# EAGLE design modulation (EAGLE 9.2.2)
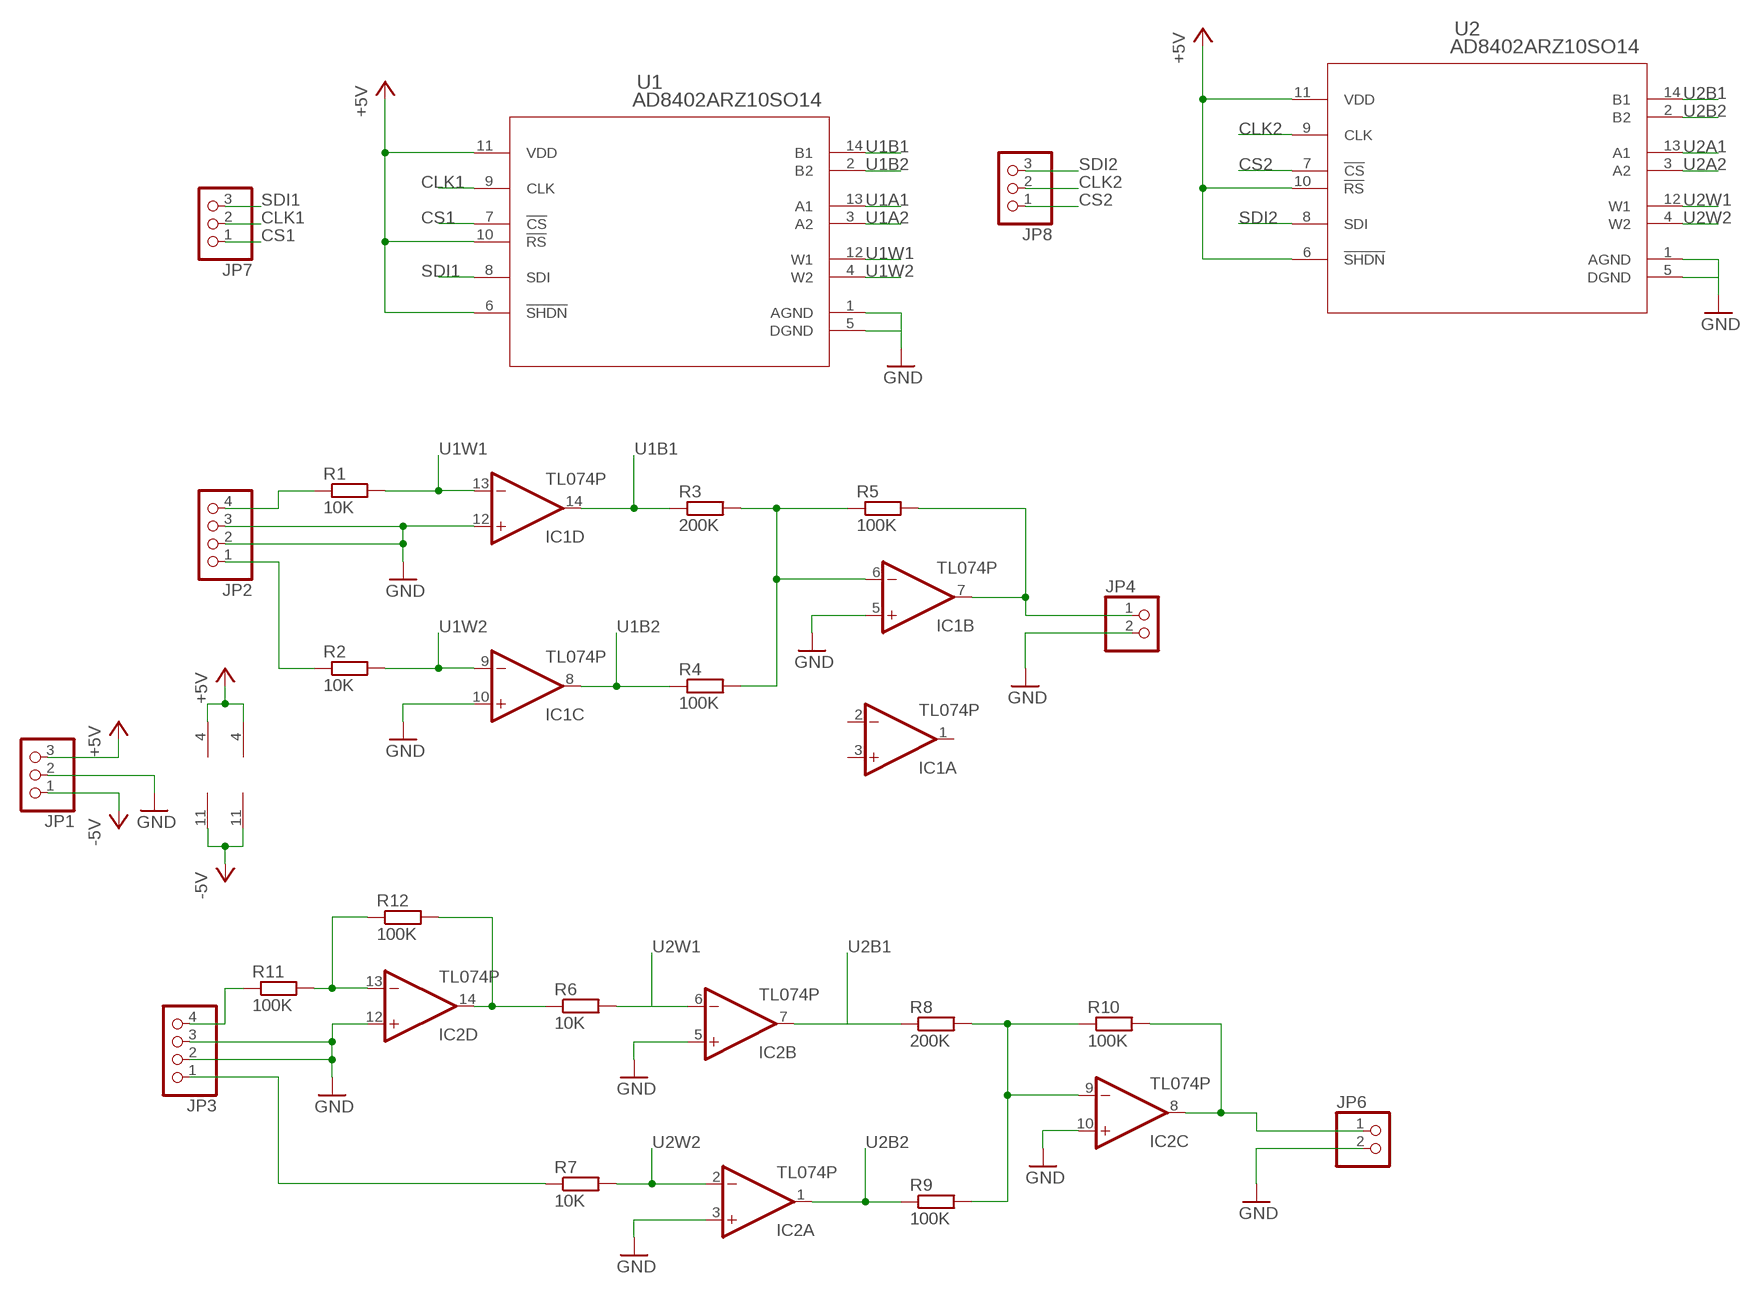
[diagram p0: schematic, sheet 1]

## Parts
IC1  TL074P  [DIL14]
IC2  TL074P  [DIL14]
JP1  PINHD-1X3  [1X03]
JP2  PINHD-1X4  [1X04]
JP3  PINHD-1X4  [1X04]
JP4  PINHD-1X2  [1X02]
JP6  PINHD-1X2  [1X02]
JP7  PINHD-1X3  [1X03]
JP8  PINHD-1X3  [1X03]
R1  10K  R-EU_0207/7  [0207/7]
R2  10K  R-EU_0207/7  [0207/7]
R3  200K  R-EU_0207/7  [0207/7]
R4  100K  R-EU_0207/7  [0207/7]
R5  100K  R-EU_0207/7  [0207/7]
R6  10K  R-EU_0207/7  [0207/7]
R7  10K  R-EU_0207/7  [0207/7]
R8  200K  R-EU_0207/7  [0207/7]
R9  100K  R-EU_0207/7  [0207/7]
R10  100K  R-EU_0207/7  [0207/7]
R11  100K  R-EU_0207/7  [0207/7]
R12  100K  R-EU_0207/7  [0207/7]
U1  AD8402ARZ10SO14  [SO14]
U2  AD8402ARZ10SO14  [SO14]

## Nets
+5V [power]: IC1.4(P:V+) IC2.4(P:V+) JP1.3 U1.6(!SHDN) U1.10(!RS) U1.11(VDD) U2.6(!SHDN) U2.10(!RS) U2.11(VDD)
-5V [power]: IC1.11(P:V-) IC2.11(P:V-) JP1.1
CLK1: JP7.2 U1.9(CLK)
CLK2: JP8.2 U2.9(CLK)
CS1: JP7.1 U1.7(!CS)
CS2: JP8.1 U2.7(!CS)
GND [power]: IC1.5(B:+IN) IC1.10(C:+IN) IC1.12(D:+IN) IC2.3(A:+IN) IC2.5(B:+IN) IC2.10(C:+IN) IC2.12(D:+IN) JP1.2 JP2.2 JP2.3 JP3.2 JP3.3 JP4.2 JP6.2 U1.1(AGND) U1.5(DGND) U2.1(AGND) U2.5(DGND)
N$1: IC1.6(B:-IN) R3.2 R4.2 R5.1
N$2: JP2.4 R1.1
N$3: JP2.1 R2.1
N$4: IC2.14(D:OUT) R6.1 R12.2
N$5: IC1.7(B:OUT) JP4.1 R5.2
N$6: JP3.1 R7.1
N$7: IC2.9(C:-IN) R8.2 R9.2 R10.1
N$8: IC2.8(C:OUT) JP6.1 R10.2
N$9: JP3.4 R11.1
N$10: IC2.13(D:-IN) R11.2 R12.1
SDI1: JP7.3 U1.8(SDI)
SDI2: JP8.3 U2.8(SDI)
U1A1: U1.13(A1)
U1A2: U1.3(A2)
U1B1: IC1.14(D:OUT) R3.1 U1.14(B1)
U1B2: IC1.8(C:OUT) R4.1 U1.2(B2)
U1W1: IC1.13(D:-IN) R1.2 U1.12(W1)
U1W2: IC1.9(C:-IN) R2.2 U1.4(W2)
U2A1: U2.13(A1)
U2A2: U2.3(A2)
U2B1: IC2.7(B:OUT) R8.1 U2.14(B1)
U2B2: IC2.1(A:OUT) R9.1 U2.2(B2)
U2W1: IC2.6(B:-IN) R6.2 U2.12(W1)
U2W2: IC2.2(A:-IN) R7.2 U2.4(W2)
Unconnected: IC1.1(A:OUT) IC1.2(A:-IN) IC1.3(A:+IN)

## Library data of the parts
IC1 IC2 = linear:TL074: OP AMP
JP1 JP7 JP8 = pinhead:PINHD-1X3: PIN HEADER
JP2 JP3 = pinhead:PINHD-1X4: PIN HEADER
JP4 JP6 = pinhead:PINHD-1X2: PIN HEADER
R1-R12 = rcl:R-EU_: RESISTOR, European symbol; SPICEPREFIX: R
U1 U2 = cusotm_comps:AD8402ARZ10

## Net classes
0 signal: width 0.3 mm, drill 0.5 mm, clearance 0.3 mm
1 power: width 0.3 mm, drill 0.5 mm, clearance 0.5 mm to class 0, clearance 0.5 mm

## Board
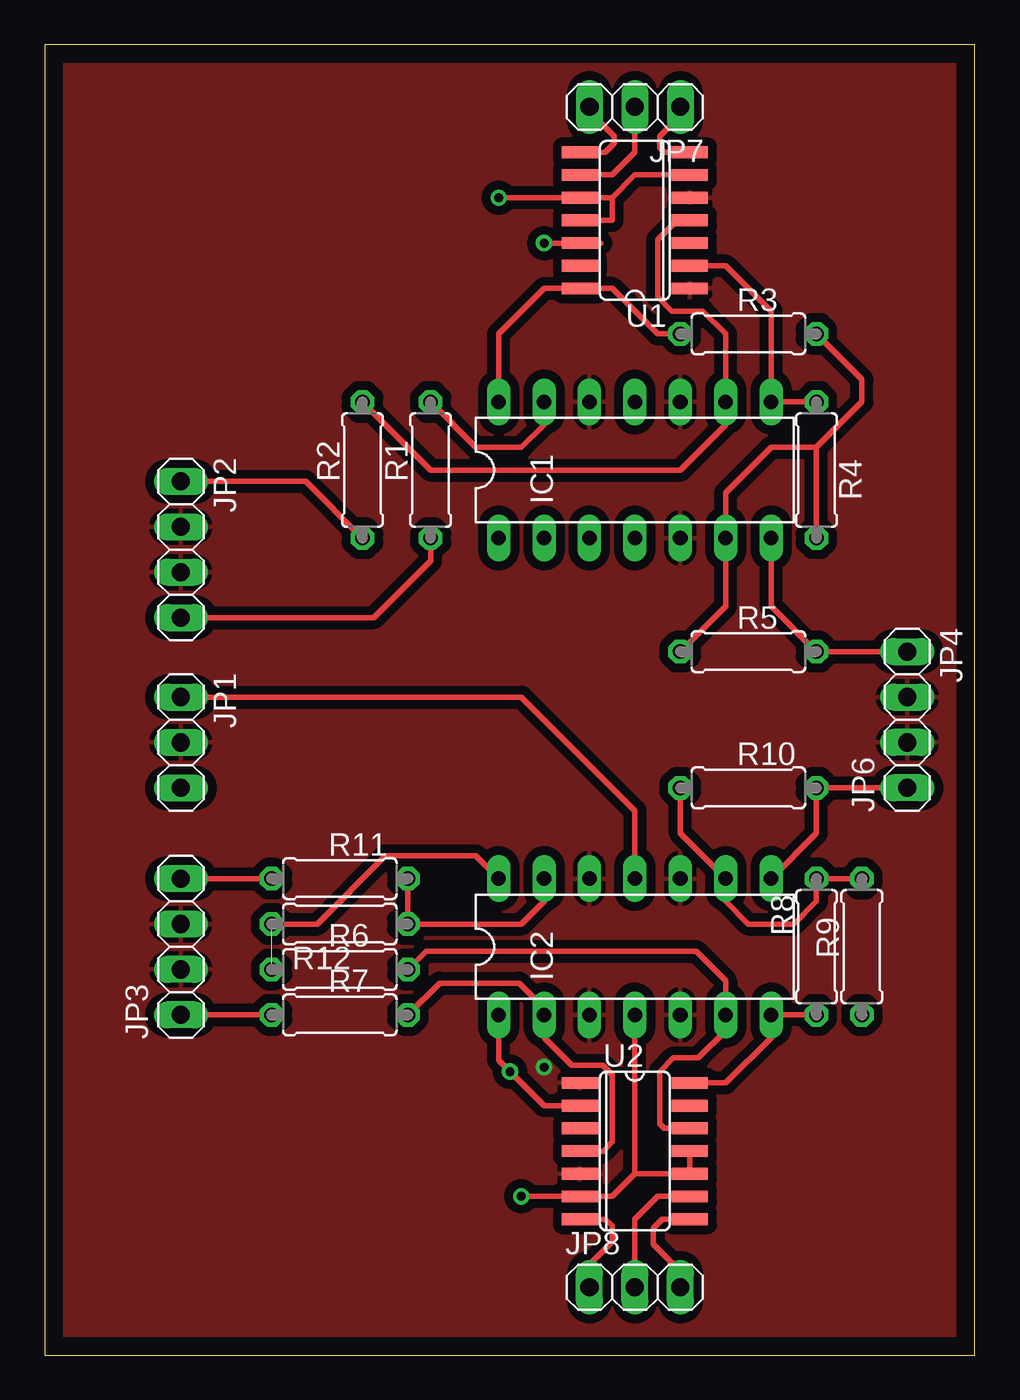
[diagram p1: board, top side]
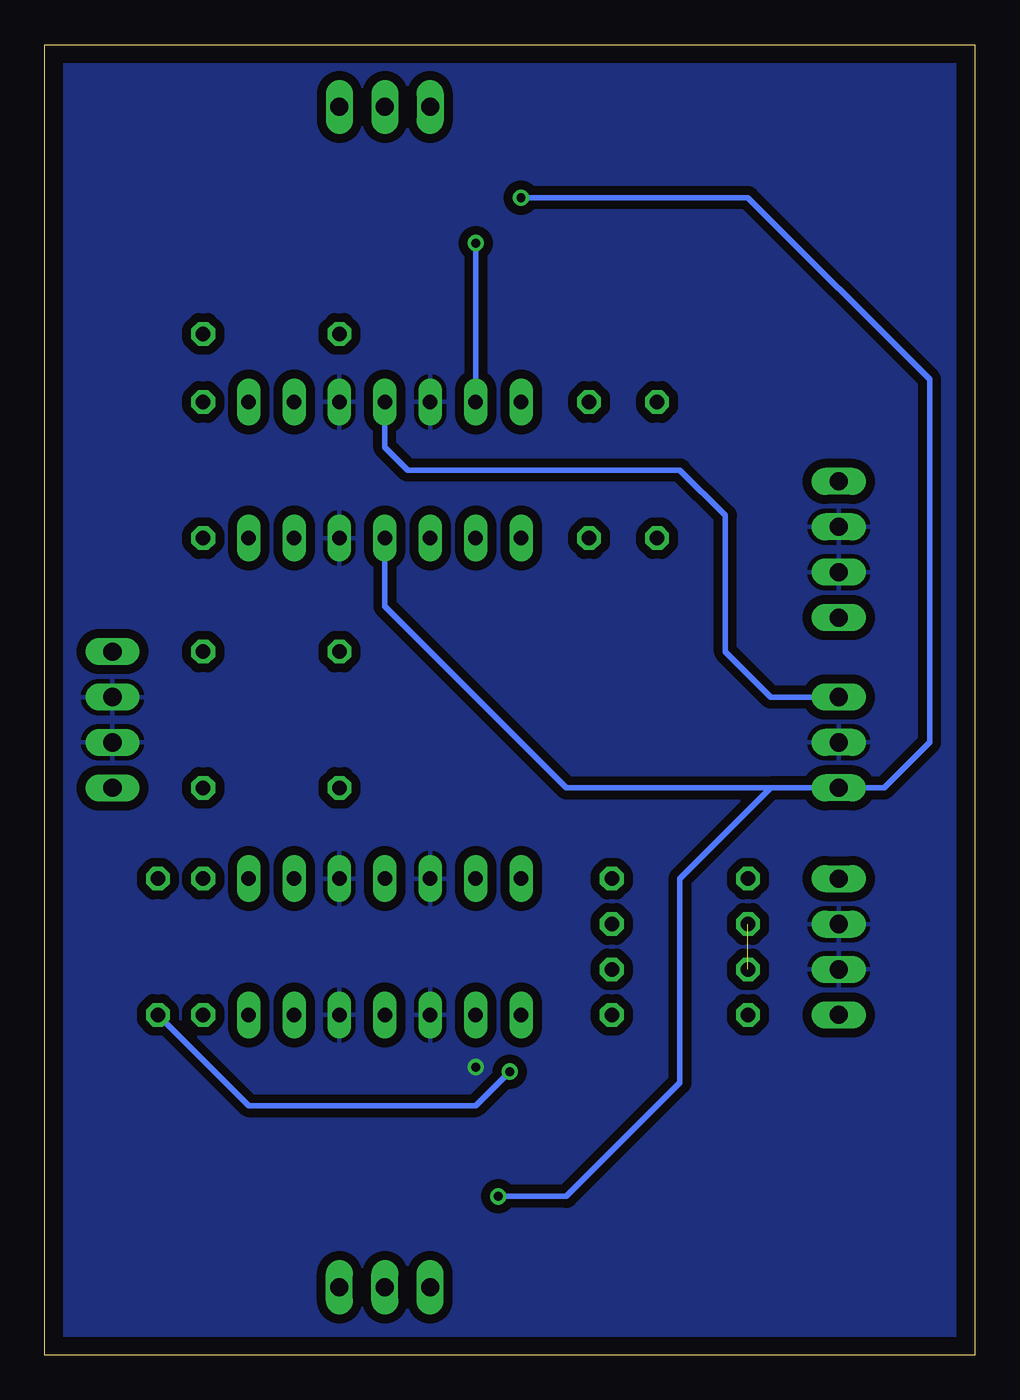
[diagram p2: board, bottom side, seen from below]

Size 52.05 x 73.33 mm. Coordinates in mm from the lower left corner, seen from the top.
Outline: 0,0 52.05,0 52.05,73.33 0,73.33 0,0
Copper layers (1*16): Top 0.035mm / dielectric 1.5mm / Bottom 0.035mm
Design rules "default": minimum track width 6mil, minimum drill 0.35mm, track to track 6mil, track to pad 6mil, pad to pad 6mil, via to via 6mil, smd to smd 6mil, copper to edge 40mil, drill to drill 6mil, minimum pad ring 10mil, minimum via ring 8mil, stop-mask expansion 4mil, vias tented up to drill 0mil, thermal gap 10mil

### Footprints (pad centres in the part's own frame; a part is rotated, then mirrored left to right if it is on the bottom)
DIL14 = drill 0.813 long: 1 -7.62,-3.81; 2 -5.08,-3.81; 3 -2.54,-3.81; 4 0,-3.81; 5 2.54,-3.81; 6 5.08,-3.81; 7 7.62,-3.81; 8 7.62,3.81; 9 5.08,3.81; 10 2.54,3.81; 11 0,3.81; 12 -2.54,3.81; 13 -5.08,3.81; 14 -7.62,3.81
1X03 = drill 1.016 long: 1 -2.54,0; 2 0,0; 3 2.54,0
1X04 = drill 1.016 long: 1 -3.81,0; 2 -1.27,0; 3 1.27,0; 4 3.81,0
1X02 = drill 1.016 long: 1 -1.27,0; 2 1.27,0
0207/7 = drill 0.813 octagon: 1 -3.81,0; 2 3.81,0
SO14 = smd 0.66 x 2.032: 1 -3.81,-3.073; 2 -2.54,-3.073; 3 -1.27,-3.073; 4 0,-3.073; 5 1.27,-3.073; 6 2.54,-3.073; 7 3.81,-3.073; 8 3.81,3.073; 9 2.54,3.073; 10 1.27,3.073; 11 0,3.073; 12 -1.27,3.073; 13 -2.54,3.073; 14 -3.81,3.073

### Placement (x,y rotation side)
IC1  33.02,49.53 0 top
IC2  33.02,22.86 0 top
JP1  7.62,34.29 270 top
JP2  7.62,45.09 270 top
JP3  7.62,22.86 90 top
JP4  48.26,38.1 270 top
JP6  48.26,33.02 90 top
JP7  33.02,69.85 180 top
JP8  33.02,3.81 0 top
R1  21.59,49.53 90 top
R2  17.78,49.53 90 top
R3  39.37,57.15 0 top
R4  43.18,49.53 270 top
R5  39.37,39.37 0 top
R6  16.51,21.59 0 top
R7  16.51,19.05 0 top
R8  43.18,22.86 90 top
R9  45.72,22.86 90 top
R10  39.37,31.75 0 top
R11  16.51,26.67 0 top
R12  16.51,24.13 180 top
U1  33.02,63.5 90 top
U2  33.02,11.43 270 top

### Tracks (layer width: path | path; a pad name or v marks a point on that pad's centre or on a via)
+5V  (via drill 0.5)
  Top 0.3: 33.02,10.16 31.75,8.89 U2.6 v26.67,8.89 | 33.02,10.16 U2.10 U2.11 | 33.02,10.16 IC2.4 | U1.11 31.75,63.5 31.75,64.77 | 31.75,64.77 U1.10 v25.4,64.77 | 31.75,64.77 33.02,66.04 U1.6
  Bottom 0.3: IC1.4 33.02,41.91 22.86,31.75 JP1.3 | JP1.3 11.43,31.75 16.51,26.67 16.51,15.24 22.86,8.89 v26.67,8.89 | JP1.3 5.08,31.75 2.54,34.29 2.54,54.61 12.7,64.77 v25.4,64.77
-5V
  Top 0.3: IC2.11 33.02,30.48 26.67,36.83 JP1.1
  Bottom 0.3: JP1.1 11.43,36.83 13.97,39.37 13.97,46.99 16.51,49.53 31.75,49.53 33.02,50.8 IC1.11
CLK1
  Top 0.3: U1.9 31.75,66.04 33.02,67.31 JP7.2
CLK2
  Top 0.3: JP8.2 33.02,7.62 34.29,8.89 U2.9
CS1
  Top 0.3: U1.7 34.67,67.31 34.42,67.56 34.42,68.2 35.56,69.34 JP7.1
CS2
  Top 0.3: U2.7 31.37,7.62 31.75,7.24 31.75,6.35 30.48,5.08 JP8.1
GND  (via drill 0.5)
  Top 0.3: U2.1 29.77,15.42 29.17,15.42
  other vias: 27.94,16.13
  pour Top: -8.89,-6.35 -8.89,80.01 16.51,105.41 144.78,105.41 167.64,82.55 167.64,22.86 138.43,-6.35
  pour Bottom: -3.81,-3.81 -3.81,81.28 24.13,109.22 133.35,109.22 171.45,71.12 171.45,15.24 147.32,-8.89 1.27,-8.89
N$1
  Top 0.3: R4.2 43.18,50.8 | 43.18,50.8 45.72,53.34 45.72,54.61 R3.2 | 43.18,50.8 40.64,50.8 38.1,48.26 IC1.6 38.1,41.91 R5.1
N$2
  Top 0.3: JP2.4 18.41,41.27 21.59,44.45 R1.1
N$3
  Top 0.3: JP2.1 14.61,48.9 R2.1
N$4  (1 unrouted)
  Top 0.3: R12.2 15.24,24.13 19.05,27.94 24.13,27.94 IC2.14
N$5
  Top 0.3: IC1.7 40.64,41.91 R5.2 JP4.1
N$6
  Top 0.3: JP3.1 R7.1
N$7
  Top 0.3: R10.1 35.56,29.21 IC2.9 38.1,25.4 39.37,24.13 41.91,24.13 43.18,25.4 R8.2 R9.2
N$8
  Top 0.3: IC2.8 43.18,29.21 R10.2 JP6.1
N$9
  Top 0.3: JP3.4 R11.1
N$10
  Top 0.3: R11.2 R12.1 26.67,24.13 27.94,25.4 IC2.13
SDI1
  Top 0.3: U1.8 31.37,67.31 31.88,67.82 31.88,68.2 30.48,69.6 JP7.3
SDI2
  Top 0.3: U2.8 34.54,7.62 34.04,7.11 34.04,6.22 35.56,4.7 JP8.3
U1B1
  Top 0.3: IC1.14 25.4,57.15 27.94,59.69 U1.14 31.75,59.69 34.29,57.15 R3.1
U1B2
  Top 0.3: U1.2 38.1,60.96 40.64,58.42 IC1.8 R4.1
U1W1  (via drill 0.5)
  Top 0.3: 31.11,62.23 U1.12 v27.94,62.23 | R1.2 24.13,50.8 26.67,50.8 27.94,52.07 IC1.13
  Bottom 0.3: v27.94,62.23 IC1.13
U1W2
  Top 0.3: U1.4 35.38,63.5 34.29,62.41 34.29,59.23 35.1,58.42 36.83,58.42 38.1,57.15 IC1.9 38.1,52.07 35.56,49.53 21.59,49.53 R2.2
U2B1
  Top 0.3: U2.14 38.1,15.24 40.64,17.78 IC2.7 R8.1
U2B2  (via drill 0.5)
  Top 0.3: U2.2 27.94,13.97 v26.04,15.88 25.4,16.51 IC2.1
  Bottom 0.3: R9.1 40.64,13.97 27.94,13.97 v26.04,15.88
U2W1
  Top 0.3: U2.12 34.67,12.7 34.42,12.95 34.42,15.88 35.18,16.64 36.58,16.64 38.1,18.16 IC2.6 38.1,20.95 36.45,22.61 21.34,22.61 R6.2
U2W2
  Top 0.3: U2.4 31.24,11.43 31.75,11.94 31.75,15.7 31.23,16.22 29.5,16.22 27.94,17.78 IC2.2 27.94,19.43 26.54,20.83 22.1,20.83 R7.2